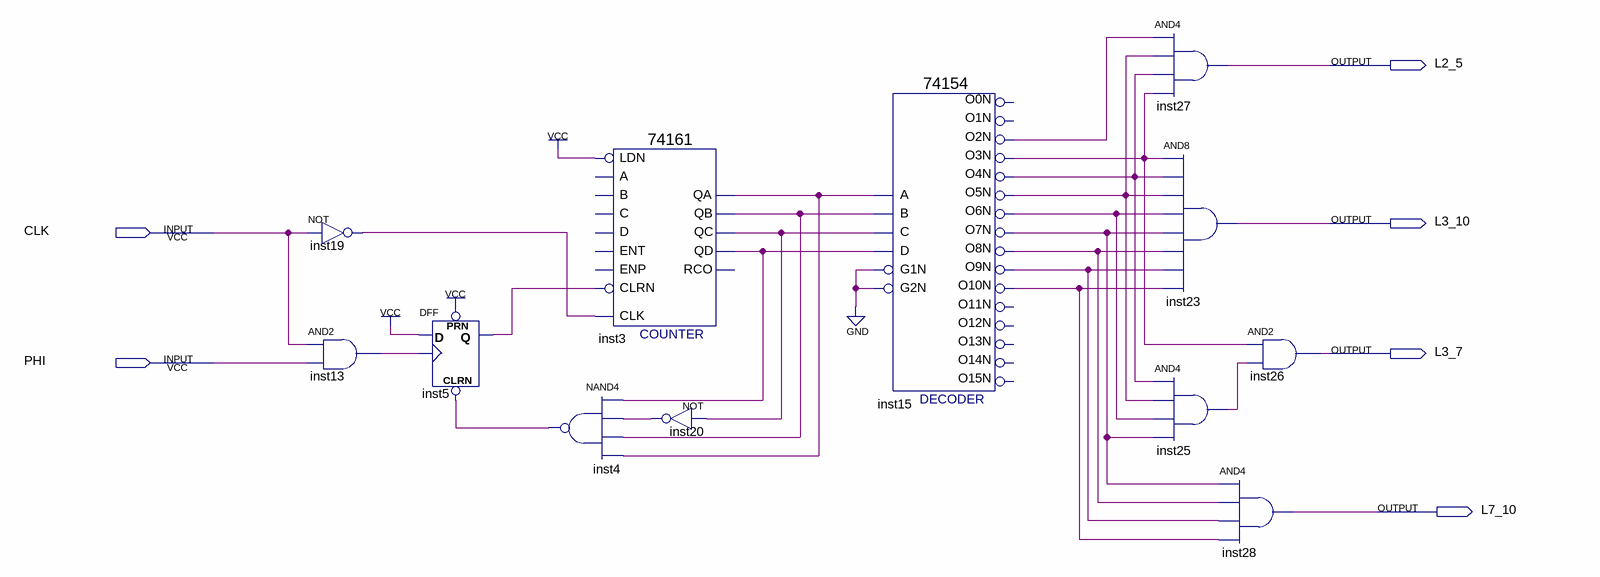
[diagram p0: schematic sheet]
// Quartus schematic sequenceur.bdf as structural Verilog: 12 symbols, 6 pins
module sequenceur (
  input  CLK,
  input  PHI,
  output L2_5,
  output L3_10,
  output L3_7,
  output L7_10
);

  wire inst3_qa, inst3_qb, inst3_qc, inst3_qd, inst4_out, inst5_q, inst13_out, inst15_o2n, inst15_o3n,
       inst15_o4n, inst15_o5n, inst15_o6n, inst15_o7n, inst15_o8n, inst15_o9n, inst15_o10n, inst19_out,
       inst20_out, inst25_out;

  not inst19 (inst19_out, CLK);
  and inst13 (inst13_out, CLK, PHI);
  DFF inst5 (.CLRN(inst4_out), .CLK(inst13_out), .D(1'b1), .PRN(1'b1), .Q(inst5_q));
  nand inst4 (inst4_out, inst3_qd, inst20_out, inst3_qb, inst3_qa);
  \74161  inst3 (
    .CLRN(inst5_q), .CLK(inst19_out), .LDN(1'b1), .QD(inst3_qd), .QC(inst3_qc), .QB(inst3_qb), .QA(inst3_qa));  // open: ENP, A, D, ENT, B, C, RCO
  not inst20 (inst20_out, inst3_qc);
  \74154  inst15 (
    .C(inst3_qc), .D(inst3_qd), .B(inst3_qb), .A(inst3_qa), .G1N(1'b0), .G2N(1'b0), .O10N(inst15_o10n),
    .O4N(inst15_o4n), .O3N(inst15_o3n), .O2N(inst15_o2n), .O7N(inst15_o7n), .O6N(inst15_o6n),
    .O5N(inst15_o5n), .O9N(inst15_o9n), .O8N(inst15_o8n));  // open: O0N, O12N, O15N, O11N, O1N, O13N, O14N
  and inst27 (L2_5, inst15_o2n, inst15_o5n, inst15_o4n, inst15_o3n);
  and inst23 (L3_10, inst15_o3n, inst15_o4n, inst15_o5n, inst15_o6n, inst15_o7n, inst15_o8n, inst15_o9n, inst15_o10n);
  and inst25 (inst25_out, inst15_o4n, inst15_o5n, inst15_o6n, inst15_o7n);
  and inst28 (L7_10, inst15_o7n, inst15_o8n, inst15_o9n, inst15_o10n);
  and inst26 (L3_7, inst15_o3n, inst25_out);
endmodule
